# EAGLE design tlv61220 (EAGLE 7.1.0)
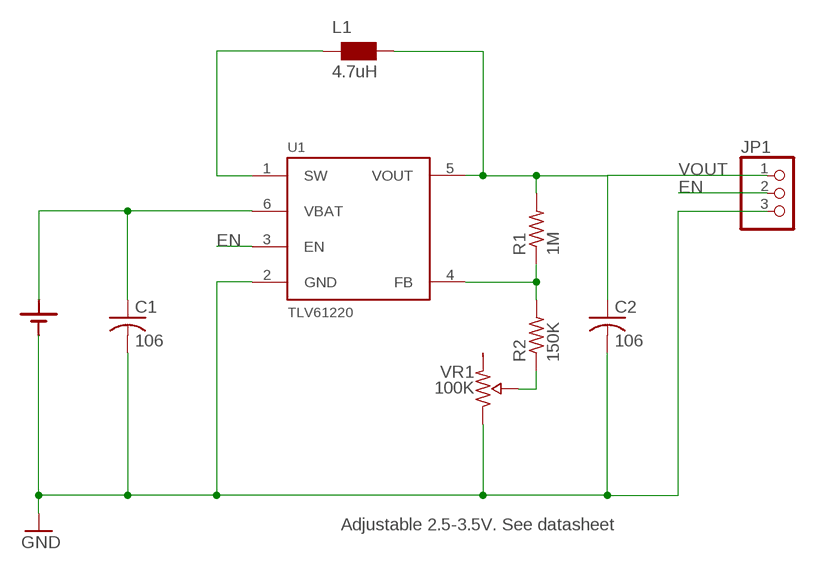
[diagram p0: schematic, sheet 1]

## Parts
C1  106  C-1206  [1206]
C2  106  C-1206  [1206]
JP1  PINHD-1X03_2.54-S  [1X03-S]
L1  4.7uH  WE-KI_0805_B  [WE-KI_0805_B]
R1  1M  R0603  [0603]
R2  150K  R0603  [0603]
U1  TLV61220  [SOT23-6]
U$1  LR44_PTH  [LR44]
VR1  100K  TRIM-2X2.5  [POT_0.2X0.25]

## Nets
EN: JP1.2 U1.3(EN)
GND: C1.2(-) C2.2(-) JP1.3 U1.2(GND) U$1.GND(-) VR1.A
N$1: C1.1(+) U1.6(VBAT) U$1.+1(+) U$1.+2(+)
N$2: R1.1 R2.2 U1.4(FB)
N$3: R2.1 VR1.W(WIPER)
SW: L1.2 U1.1(SW)
VOUT: C2.1(+) JP1.1 L1.1 R1.2 U1.5(VOUT)
Unconnected: VR1.B

## Notes on the sheet
- Adjustable 2.5-3.5V. See datasheet

## Library data of the parts
C1 C2 = bt_rcl:C: Capacitor, non-polarized, American symbol
JP1 = pinhead-2:PINHD-1X03: PIN HEADER
L1 = wuerth-elektronik:WE-KI: SMD Wire Wound Ceramic Inductor WE-KI - Wire wound - High thermal stability - Rated current up to 1 A - High Q-factor - High SRF -- Especially developed for high frequency applications -- Perfect for applications in telecommunications -- Bluetooth -- Wireless LAN
R1 R2 = bt_rcl:R: Resistor, American symbol
U1 = bt_regulator:TLV61220: TLV61220 Low-Input Voltage Step-Up Voltage Converter / Regulator The TLV61220 device provides a power-supply solution for products powered by either a single-cell, two-cell, or three-cell alkaline, NiCd or NiMH, or one-cell Li-Ion or Li-polymer battery. Possible output Features: Up to 95% Efficiency at Typical Operating Conditions 5.5-μA Quiescent Current Startup Into Load at 0.7-V Input Voltage currents depend on the input-to-output voltage ratio. Operating Input Voltage from 0.7 V to 5.5 V Pass-Through Function during Shutdown Minimum Switching Current 200 mA Protections include output overvoltage, overtemperature, input undervoltage lockout Adjustable Output Voltage from 1.8 V to 5.5 V Small 6-pin Thin SOT-23 Package Datasheet: TLV61220.pdf <http://www.ti.com/lit/ds/symlink/tlv61220.pdf>
U$1 = bt_battery:LR44: LR44 1.5V Coin Cell Battery
VR1 = bt_electromech:TRIM-: POTENTIOMETER

## Board
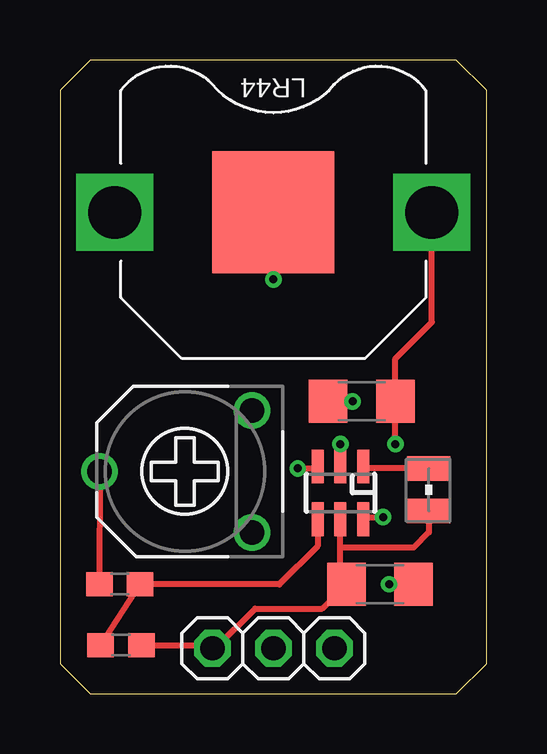
[diagram p1: board, top side]
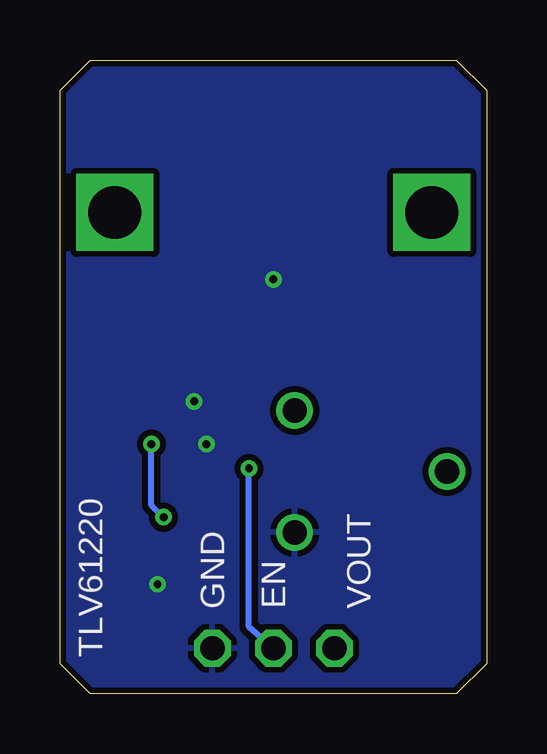
[diagram p2: board, bottom side, seen from below]

Size 17.78 x 26.42 mm. Coordinates in mm from the lower left corner, seen from the top.
Outline: 17.78,1.27 17.78,25.15 16.51,26.42 1.27,26.42 0,25.15 0,1.27 1.27,0 16.51,0 17.78,1.27
Copper layers (1*16): Top 0.0356mm / dielectric 1.5011mm / Bottom 0.0356mm
Design rules "LaenPCBOrder": minimum track width 6mil, minimum drill 13mil, track to track 10mil, track to pad 10mil, pad to pad 10mil, via to via 10mil, smd to smd 8mil, copper to edge 10mil, drill to drill 10mil, minimum pad ring 7mil, minimum via ring 7mil, stop-mask expansion 3mil, vias tented up to drill 20mil, thermal gap 10mil

### Footprints (pad centres in the part's own frame; a part is rotated, then mirrored left to right if it is on the bottom)
1206 = smd 1.6 x 1.8: 1 -1.4,0; 2 1.4,0
1X03-S = drill 1.016 octagon: 1 -2.54,0; 2 0,0; 3 2.54,0
WE-KI_0805_B = smd 1.02 x 1.78: 1 -0.89,0; 2 0.89,0
0603 = smd 1.1 x 1: 1 -0.85,0; 2 0.85,0
SOT23-6 = smd 0.5 x 1.4: 1 -0.95,-1.1; 2 0,-1.1; 3 0.95,-1.1; 4 0.95,1.1; 5 0,1.1; 6 -0.95,1.1
LR44 = drill 2.2 square: +1 6.604,0; +2 -6.604,0 | smd 5.08 x 5.08: GND 0,0
POT_0.2X0.25 = drill 1.016: A -2.54,-2.54; B 2.54,-2.54; W 0,3.81

### Placement (x,y rotation side)
C1  12.57,12.19 180 top
C2  13.34,4.57 0 top
JP1  8.89,1.91 0 top
L1  15.37,8.51 90 top
R1  2.54,2.03 0 top
R2  2.49,4.57 0 top
U1  11.68,8.38 180 top
U$1  8.89,20.07 0 top
VR1  5.46,9.27 90 top

### Tracks (layer width: path | path; a pad name or v marks a point on that pad's centre or on a via)
EN  (via drill 0.33)
  Top 0.254: v9.91,9.4 10.65,9.4 U1.3
  Bottom 0.254: JP1.2 9.91,2.79 v9.91,9.4
GND  (via drill 0.33)
  Top 0.254: U1.2 v11.68,10.41 | C1.2 v12.19,12.19 | C2.2 v13.72,4.57 | U$1.GND v8.89,17.27
  pour Bottom: 17.78,26.54 17.78,1.27 16.51,0 1.27,0 0,1.27 0,26.54
N$1  (via drill 0.33)
  Top 0.254: U1.6 12.72,7.37 v13.46,7.37 | v13.97,10.41 v13.97,10.42 C1.1 13.97,13.97 15.49,15.49 U$1.+1
  Bottom 0.254: v13.46,7.37 13.97,7.87 v13.97,10.41
N$2
  Top 0.254: U1.4 10.73,6.16 9.14,4.57 R2.2 R1.1
N$3
  Top 0.254: VR1.W R2.1
SW
  Top 0.254: L1.2 12.72,9.4 U1.1
VOUT
  Top 0.254: L1.1 15.37,6.73 14.73,6.1 11.68,6.1 | 11.68,6.1 U1.5 | 11.68,6.1 11.68,4.82 C2.1 10.92,3.56 8.13,3.56 6.48,1.91 JP1.1 6.22,2.03 R1.2

### Text on the board
bNames: VOUT | EN | GND | TLV61220